# EAGLE schematic rgblight (EAGLE 5.06)
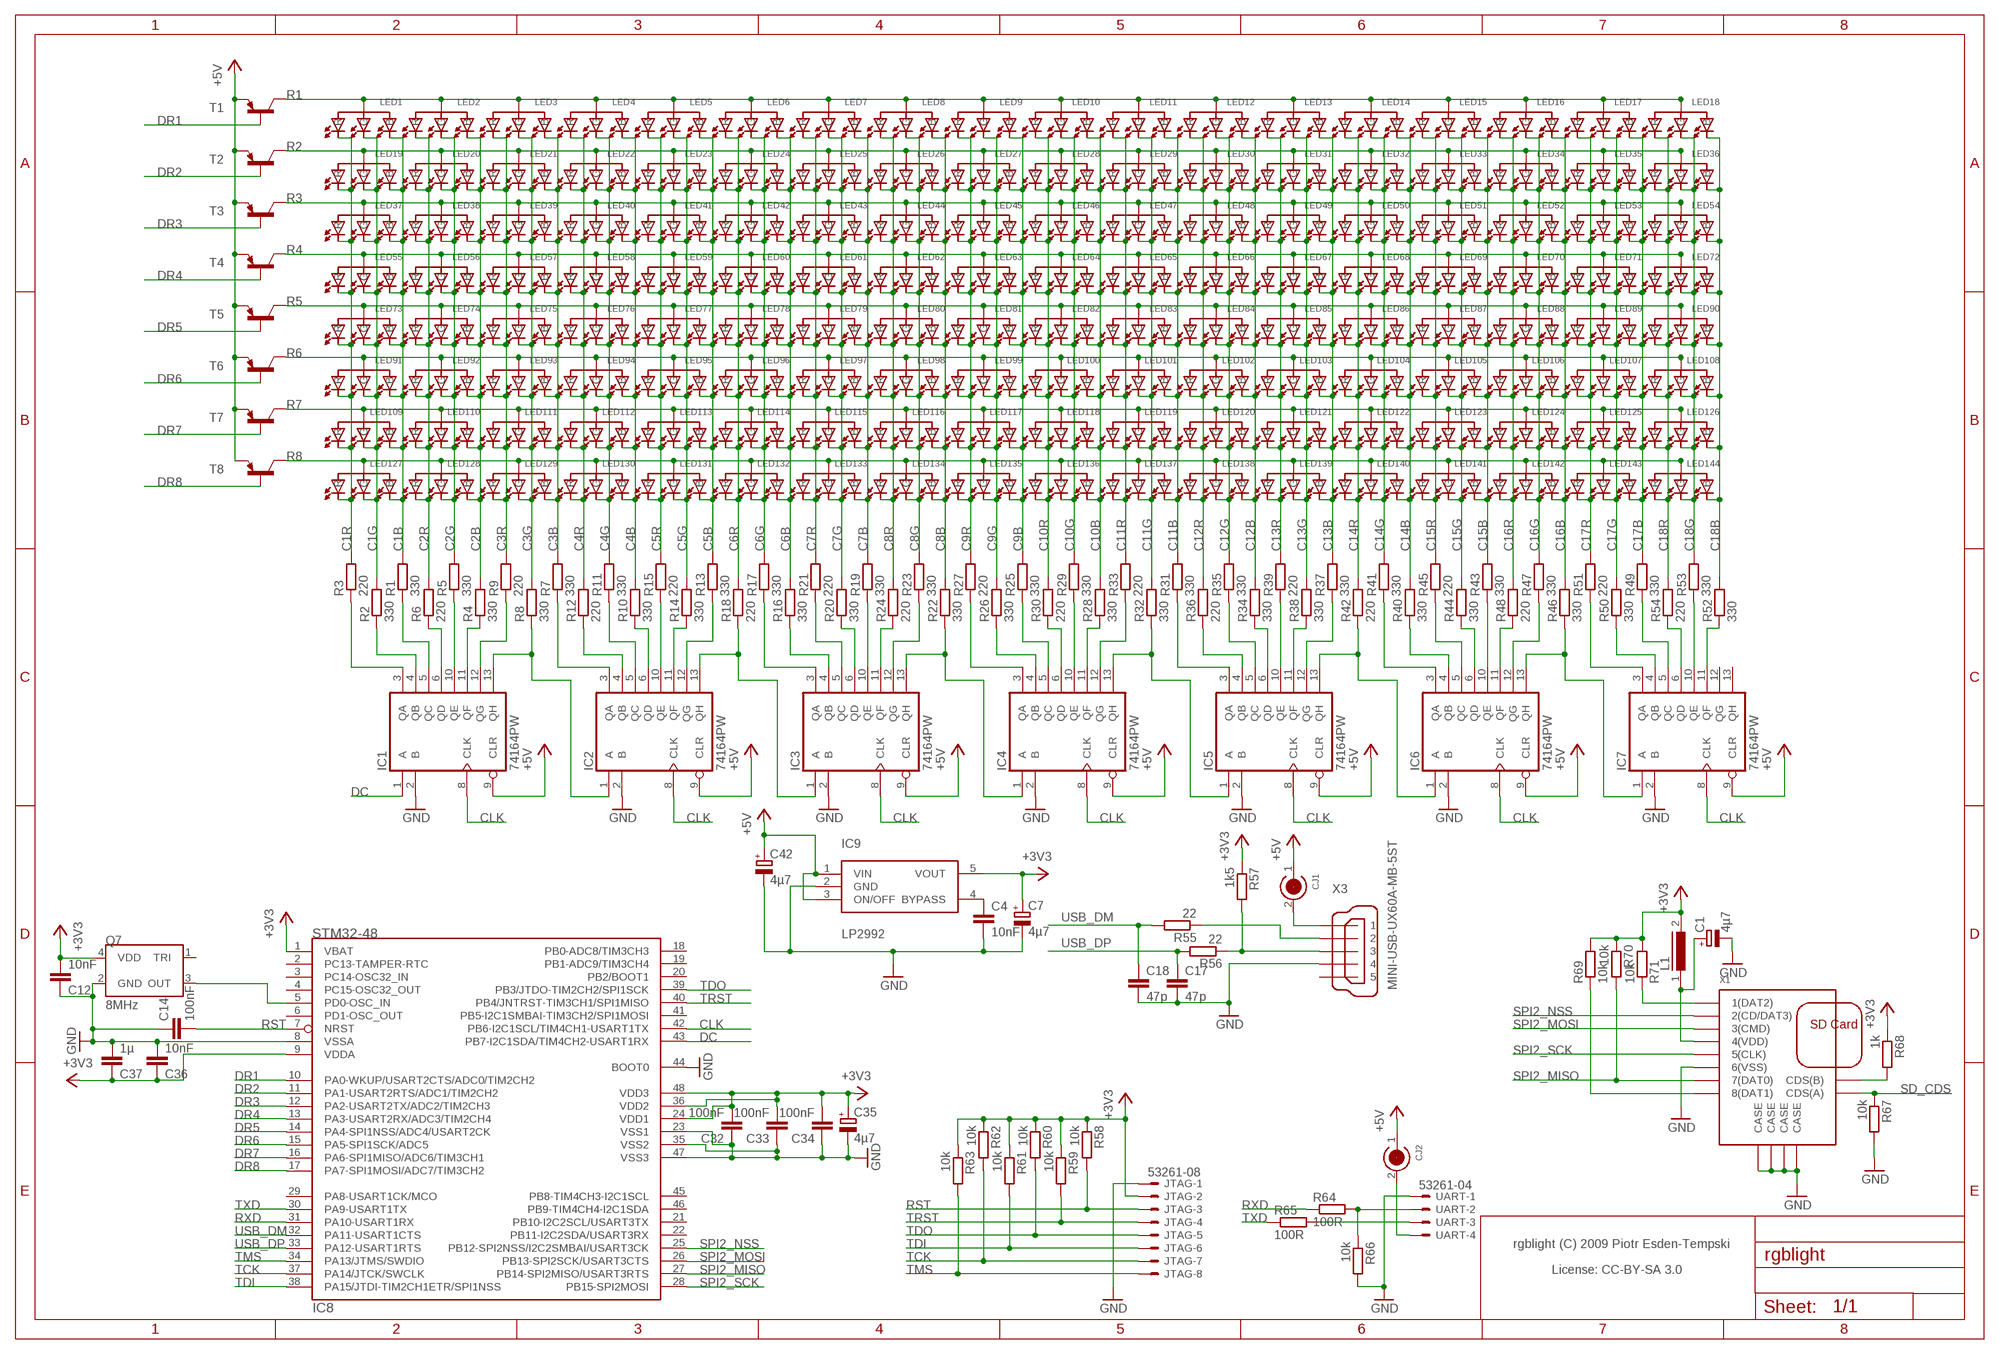
[diagram p0: schematic, sheet 1]

## Parts
C1  4µ7  CPOL-EUA/3216-18R  [A/3216-18R]
C4  10nF  C-EUC0402  [C0402]
C7  4µ7  CPOL-EUA/3216-18R  [A/3216-18R]
C12  10nF  C-EUC0402  [C0402]
C14  100nF  C-EUC0402  [C0402]
C17  47p  C-EUC0402  [C0402]
C18  47p  C-EUC0402  [C0402]
C32  100nF  C-EUC0402  [C0402]
C33  100nF  C-EUC0402  [C0402]
C34  100nF  C-EUC0402  [C0402]
C35  4µ7  CPOL-EUA/3216-18R  [A/3216-18R]
C36  10nF  C-EUC0402  [C0402]
C37  1µ  C-EUC0402  [C0402]
C42  4µ7  CPOL-EUA/3216-18R  [A/3216-18R]
CJ1  CIRC_JMP  [CIRC_JMP]
CJ2  CIRC_JMP  [CIRC_JMP]
IC1  74164PW  [TSSOP14]
IC2  74164PW  [TSSOP14]
IC3  74164PW  [TSSOP14]
IC4  74164PW  [TSSOP14]
IC5  74164PW  [TSSOP14]
IC6  74164PW  [TSSOP14]
IC7  74164PW  [TSSOP14]
IC8  STM32-48  [TQFP48]
IC9  LP2992  [SOT23-5]
JTAG  53261-08  [53261-08]
L1  I0603  [R0603]
LED1  OVSRRGB  [OVSRRGB]
LED2  OVSRRGB  [OVSRRGB]
LED3  OVSRRGB  [OVSRRGB]
LED4  OVSRRGB  [OVSRRGB]
LED5  OVSRRGB  [OVSRRGB]
LED6  OVSRRGB  [OVSRRGB]
LED7  OVSRRGB  [OVSRRGB]
LED8  OVSRRGB  [OVSRRGB]
LED9  OVSRRGB  [OVSRRGB]
LED10  OVSRRGB  [OVSRRGB]
LED11  OVSRRGB  [OVSRRGB]
LED12  OVSRRGB  [OVSRRGB]
LED13  OVSRRGB  [OVSRRGB]
LED14  OVSRRGB  [OVSRRGB]
LED15  OVSRRGB  [OVSRRGB]
LED16  OVSRRGB  [OVSRRGB]
LED17  OVSRRGB  [OVSRRGB]
LED18  OVSRRGB  [OVSRRGB]
LED19  OVSRRGB  [OVSRRGB]
LED20  OVSRRGB  [OVSRRGB]
LED21  OVSRRGB  [OVSRRGB]
LED22  OVSRRGB  [OVSRRGB]
LED23  OVSRRGB  [OVSRRGB]
LED24  OVSRRGB  [OVSRRGB]
LED25  OVSRRGB  [OVSRRGB]
LED26  OVSRRGB  [OVSRRGB]
LED27  OVSRRGB  [OVSRRGB]
LED28  OVSRRGB  [OVSRRGB]
LED29  OVSRRGB  [OVSRRGB]
LED30  OVSRRGB  [OVSRRGB]
LED31  OVSRRGB  [OVSRRGB]
LED32  OVSRRGB  [OVSRRGB]
LED33  OVSRRGB  [OVSRRGB]
LED34  OVSRRGB  [OVSRRGB]
LED35  OVSRRGB  [OVSRRGB]
LED36  OVSRRGB  [OVSRRGB]
LED37  OVSRRGB  [OVSRRGB]
LED38  OVSRRGB  [OVSRRGB]
LED39  OVSRRGB  [OVSRRGB]
LED40  OVSRRGB  [OVSRRGB]
LED41  OVSRRGB  [OVSRRGB]
LED42  OVSRRGB  [OVSRRGB]
LED43  OVSRRGB  [OVSRRGB]
LED44  OVSRRGB  [OVSRRGB]
LED45  OVSRRGB  [OVSRRGB]
LED46  OVSRRGB  [OVSRRGB]
LED47  OVSRRGB  [OVSRRGB]
LED48  OVSRRGB  [OVSRRGB]
LED49  OVSRRGB  [OVSRRGB]
LED50  OVSRRGB  [OVSRRGB]
LED51  OVSRRGB  [OVSRRGB]
LED52  OVSRRGB  [OVSRRGB]
LED53  OVSRRGB  [OVSRRGB]
LED54  OVSRRGB  [OVSRRGB]
LED55  OVSRRGB  [OVSRRGB]
LED56  OVSRRGB  [OVSRRGB]
LED57  OVSRRGB  [OVSRRGB]
LED58  OVSRRGB  [OVSRRGB]
LED59  OVSRRGB  [OVSRRGB]
LED60  OVSRRGB  [OVSRRGB]
LED61  OVSRRGB  [OVSRRGB]
LED62  OVSRRGB  [OVSRRGB]
LED63  OVSRRGB  [OVSRRGB]
LED64  OVSRRGB  [OVSRRGB]
LED65  OVSRRGB  [OVSRRGB]
LED66  OVSRRGB  [OVSRRGB]
LED67  OVSRRGB  [OVSRRGB]
LED68  OVSRRGB  [OVSRRGB]
LED69  OVSRRGB  [OVSRRGB]
LED70  OVSRRGB  [OVSRRGB]
LED71  OVSRRGB  [OVSRRGB]
LED72  OVSRRGB  [OVSRRGB]
LED73  OVSRRGB  [OVSRRGB]
LED74  OVSRRGB  [OVSRRGB]
LED75  OVSRRGB  [OVSRRGB]
LED76  OVSRRGB  [OVSRRGB]
LED77  OVSRRGB  [OVSRRGB]
LED78  OVSRRGB  [OVSRRGB]
LED79  OVSRRGB  [OVSRRGB]
LED80  OVSRRGB  [OVSRRGB]
LED81  OVSRRGB  [OVSRRGB]
LED82  OVSRRGB  [OVSRRGB]
LED83  OVSRRGB  [OVSRRGB]
LED84  OVSRRGB  [OVSRRGB]
LED85  OVSRRGB  [OVSRRGB]
LED86  OVSRRGB  [OVSRRGB]
LED87  OVSRRGB  [OVSRRGB]
LED88  OVSRRGB  [OVSRRGB]
LED89  OVSRRGB  [OVSRRGB]
LED90  OVSRRGB  [OVSRRGB]
LED91  OVSRRGB  [OVSRRGB]
LED92  OVSRRGB  [OVSRRGB]
LED93  OVSRRGB  [OVSRRGB]
LED94  OVSRRGB  [OVSRRGB]
LED95  OVSRRGB  [OVSRRGB]
LED96  OVSRRGB  [OVSRRGB]
LED97  OVSRRGB  [OVSRRGB]
LED98  OVSRRGB  [OVSRRGB]
LED99  OVSRRGB  [OVSRRGB]
LED100  OVSRRGB  [OVSRRGB]
LED101  OVSRRGB  [OVSRRGB]
LED102  OVSRRGB  [OVSRRGB]
LED103  OVSRRGB  [OVSRRGB]
LED104  OVSRRGB  [OVSRRGB]
LED105  OVSRRGB  [OVSRRGB]
LED106  OVSRRGB  [OVSRRGB]
LED107  OVSRRGB  [OVSRRGB]
LED108  OVSRRGB  [OVSRRGB]
LED109  OVSRRGB  [OVSRRGB]
LED110  OVSRRGB  [OVSRRGB]
LED111  OVSRRGB  [OVSRRGB]
LED112  OVSRRGB  [OVSRRGB]
LED113  OVSRRGB  [OVSRRGB]
LED114  OVSRRGB  [OVSRRGB]
LED115  OVSRRGB  [OVSRRGB]
LED116  OVSRRGB  [OVSRRGB]
LED117  OVSRRGB  [OVSRRGB]
LED118  OVSRRGB  [OVSRRGB]
LED119  OVSRRGB  [OVSRRGB]
LED120  OVSRRGB  [OVSRRGB]
LED121  OVSRRGB  [OVSRRGB]
LED122  OVSRRGB  [OVSRRGB]
LED123  OVSRRGB  [OVSRRGB]
LED124  OVSRRGB  [OVSRRGB]
LED125  OVSRRGB  [OVSRRGB]
LED126  OVSRRGB  [OVSRRGB]
LED127  OVSRRGB  [OVSRRGB]
LED128  OVSRRGB  [OVSRRGB]
LED129  OVSRRGB  [OVSRRGB]
LED130  OVSRRGB  [OVSRRGB]
LED131  OVSRRGB  [OVSRRGB]
LED132  OVSRRGB  [OVSRRGB]
LED133  OVSRRGB  [OVSRRGB]
LED134  OVSRRGB  [OVSRRGB]
LED135  OVSRRGB  [OVSRRGB]
LED136  OVSRRGB  [OVSRRGB]
LED137  OVSRRGB  [OVSRRGB]
LED138  OVSRRGB  [OVSRRGB]
LED139  OVSRRGB  [OVSRRGB]
LED140  OVSRRGB  [OVSRRGB]
LED141  OVSRRGB  [OVSRRGB]
LED142  OVSRRGB  [OVSRRGB]
LED143  OVSRRGB  [OVSRRGB]
LED144  OVSRRGB  [OVSRRGB]
Q7  8MHz  ASE_ASCILLATOR  [ASE_OSCILLATOR]
R1  330  R-EU_R0402  [R0402]
R2  330  R-EU_R0402  [R0402]
R3  220  R-EU_R0402  [R0402]
R4  330  R-EU_R0402  [R0402]
R5  330  R-EU_R0402  [R0402]
R6  220  R-EU_R0402  [R0402]
R7  330  R-EU_R0402  [R0402]
R8  330  R-EU_R0402  [R0402]
R9  220  R-EU_R0402  [R0402]
R10  330  R-EU_R0402  [R0402]
R11  330  R-EU_R0402  [R0402]
R12  220  R-EU_R0402  [R0402]
R13  330  R-EU_R0402  [R0402]
R14  330  R-EU_R0402  [R0402]
R15  220  R-EU_R0402  [R0402]
R16  330  R-EU_R0402  [R0402]
R17  330  R-EU_R0402  [R0402]
R18  220  R-EU_R0402  [R0402]
R19  330  R-EU_R0402  [R0402]
R20  330  R-EU_R0402  [R0402]
R21  220  R-EU_R0402  [R0402]
R22  330  R-EU_R0402  [R0402]
R23  330  R-EU_R0402  [R0402]
R24  220  R-EU_R0402  [R0402]
R25  330  R-EU_R0402  [R0402]
R26  330  R-EU_R0402  [R0402]
R27  220  R-EU_R0402  [R0402]
R28  330  R-EU_R0402  [R0402]
R29  330  R-EU_R0402  [R0402]
R30  220  R-EU_R0402  [R0402]
R31  330  R-EU_R0402  [R0402]
R32  330  R-EU_R0402  [R0402]
R33  220  R-EU_R0402  [R0402]
R34  330  R-EU_R0402  [R0402]
R35  330  R-EU_R0402  [R0402]
R36  220  R-EU_R0402  [R0402]
R37  330  R-EU_R0402  [R0402]
R38  330  R-EU_R0402  [R0402]
R39  220  R-EU_R0402  [R0402]
R40  330  R-EU_R0402  [R0402]
R41  330  R-EU_R0402  [R0402]
R42  220  R-EU_R0402  [R0402]
R43  330  R-EU_R0402  [R0402]
R44  330  R-EU_R0402  [R0402]
R45  220  R-EU_R0402  [R0402]
R46  330  R-EU_R0402  [R0402]
R47  330  R-EU_R0402  [R0402]
R48  220  R-EU_R0402  [R0402]
R49  330  R-EU_R0402  [R0402]
R50  330  R-EU_R0402  [R0402]
R51  220  R-EU_R0402  [R0402]
R52  330  R-EU_R0402  [R0402]
R53  330  R-EU_R0402  [R0402]
R54  220  R-EU_R0402  [R0402]
R55  22  R-EU_R0402  [R0402]
R56  22  R-EU_R0402  [R0402]
R57  1k5  R-EU_R0402  [R0402]
R58  10k  R-EU_R0402  [R0402]
R59  10k  R-EU_R0402  [R0402]
R60  10k  R-EU_R0402  [R0402]
R61  10k  R-EU_R0402  [R0402]
R62  10k  R-EU_R0402  [R0402]
R63  10k  R-EU_R0402  [R0402]
R64  100R  R-EU_R0402  [R0402]
R65  100R  R-EU_R0402  [R0402]
R66  10k  R-EU_R0402  [R0402]
R67  10k  R-EU_R0402  [R0402]
R68  1k  R-EU_R0402  [R0402]
R69  10k  R-EU_R0402  [R0402]
R70  10k  R-EU_R0402  [R0402]
R71  10k  R-EU_R0402  [R0402]
T1  -PNP-SOT23-BCE  [SOT23-BCE]
T2  -PNP-SOT23-BCE  [SOT23-BCE]
T3  -PNP-SOT23-BCE  [SOT23-BCE]
T4  -PNP-SOT23-BCE  [SOT23-BCE]
T5  -PNP-SOT23-BCE  [SOT23-BCE]
T6  -PNP-SOT23-BCE  [SOT23-BCE]
T7  -PNP-SOT23-BCE  [SOT23-BCE]
T8  -PNP-SOT23-BCE  [SOT23-BCE]
UART  53261-04  [53261-04]
X1  SD-SLOT-DM3D-SF  [DM3D-SF]
X3  MINI-USB-UX60A-MB-5ST  [UX60A-MB-5ST]

## Nets
+3V3: C7.+ C12.2 C32.2 C33.2 C34.2 C35.+ C36.1 C37.1 IC8.1(VBAT) IC8.9(VDDA) IC8.24(VDD1) IC8.36(VDD2) IC8.48(VDD3) IC9.5(VOUT) JTAG.2 L1.2 Q7.4(VDD) R57.1 R58.1 R59.1 R60.1 R61.1 R62.1 R63.1 R68.1 R69.2 R70.1 R71.2
+5V: C42.+ CJ1.1 CJ2.1 IC1.9(CLR) IC2.9(CLR) IC3.9(CLR) IC4.9(CLR) IC5.9(CLR) IC6.9(CLR) IC7.9(CLR) IC9.1(VIN) IC9.3(ON/OFF) T1.E T2.E T3.E T4.E T5.E T6.E T7.E T8.E
C1B: LED1.3(B) LED19.3(B) LED37.3(B) LED55.3(B) LED73.3(B) LED91.3(B) LED109.3(B) LED127.3(B) R1.2
C1G: LED1.2(G) LED19.2(G) LED37.2(G) LED55.2(G) LED73.2(G) LED91.2(G) LED109.2(G) LED127.2(G) R2.2
C1R: LED1.1(R) LED19.1(R) LED37.1(R) LED55.1(R) LED73.1(R) LED91.1(R) LED109.1(R) LED127.1(R) R3.2
C2B: LED2.3(B) LED20.3(B) LED38.3(B) LED56.3(B) LED74.3(B) LED92.3(B) LED110.3(B) LED128.3(B) R4.2
C2G: LED2.2(G) LED20.2(G) LED38.2(G) LED56.2(G) LED74.2(G) LED92.2(G) LED110.2(G) LED128.2(G) R5.2
C2R: LED2.1(R) LED20.1(R) LED38.1(R) LED56.1(R) LED74.1(R) LED92.1(R) LED110.1(R) LED128.1(R) R6.2
C3B: LED3.3(B) LED21.3(B) LED39.3(B) LED57.3(B) LED75.3(B) LED93.3(B) LED111.3(B) LED129.3(B) R7.2
C3G: LED3.2(G) LED21.2(G) LED39.2(G) LED57.2(G) LED75.2(G) LED93.2(G) LED111.2(G) LED129.2(G) R8.2
C3R: LED3.1(R) LED21.1(R) LED39.1(R) LED57.1(R) LED75.1(R) LED93.1(R) LED111.1(R) LED129.1(R) R9.2
C4B: LED4.3(B) LED22.3(B) LED40.3(B) LED58.3(B) LED76.3(B) LED94.3(B) LED112.3(B) LED130.3(B) R10.2
C4G: LED4.2(G) LED22.2(G) LED40.2(G) LED58.2(G) LED76.2(G) LED94.2(G) LED112.2(G) LED130.2(G) R11.2
C4R: LED4.1(R) LED22.1(R) LED40.1(R) LED58.1(R) LED76.1(R) LED94.1(R) LED112.1(R) LED130.1(R) R12.2
C5B: LED5.3(B) LED23.3(B) LED41.3(B) LED59.3(B) LED77.3(B) LED95.3(B) LED113.3(B) LED131.3(B) R13.2
C5G: LED5.2(G) LED23.2(G) LED41.2(G) LED59.2(G) LED77.2(G) LED95.2(G) LED113.2(G) LED131.2(G) R14.2
C5R: LED5.1(R) LED23.1(R) LED41.1(R) LED59.1(R) LED77.1(R) LED95.1(R) LED113.1(R) LED131.1(R) R15.2
C6B: LED6.3(B) LED24.3(B) LED42.3(B) LED60.3(B) LED78.3(B) LED96.3(B) LED114.3(B) LED132.3(B) R16.2
C6G: LED6.2(G) LED24.2(G) LED42.2(G) LED60.2(G) LED78.2(G) LED96.2(G) LED114.2(G) LED132.2(G) R17.2
C6R: LED6.1(R) LED24.1(R) LED42.1(R) LED60.1(R) LED78.1(R) LED96.1(R) LED114.1(R) LED132.1(R) R18.2
C7B: LED7.3(B) LED25.3(B) LED43.3(B) LED61.3(B) LED79.3(B) LED97.3(B) LED115.3(B) LED133.3(B) R19.2
C7G: LED7.2(G) LED25.2(G) LED43.2(G) LED61.2(G) LED79.2(G) LED97.2(G) LED115.2(G) LED133.2(G) R20.2
C7R: LED7.1(R) LED25.1(R) LED43.1(R) LED61.1(R) LED79.1(R) LED97.1(R) LED115.1(R) LED133.1(R) R21.2
C8B: LED8.3(B) LED26.3(B) LED44.3(B) LED62.3(B) LED80.3(B) LED98.3(B) LED116.3(B) LED134.3(B) R22.2
C8G: LED8.2(G) LED26.2(G) LED44.2(G) LED62.2(G) LED80.2(G) LED98.2(G) LED116.2(G) LED134.2(G) R23.2
C8R: LED8.1(R) LED26.1(R) LED44.1(R) LED62.1(R) LED80.1(R) LED98.1(R) LED116.1(R) LED134.1(R) R24.2
C9B: LED9.3(B) LED27.3(B) LED45.3(B) LED63.3(B) LED81.3(B) LED99.3(B) LED117.3(B) LED135.3(B) R25.2
C9G: LED9.2(G) LED27.2(G) LED45.2(G) LED63.2(G) LED81.2(G) LED99.2(G) LED117.2(G) LED135.2(G) R26.2
C9R: LED9.1(R) LED27.1(R) LED45.1(R) LED63.1(R) LED81.1(R) LED99.1(R) LED117.1(R) LED135.1(R) R27.2
C10B: LED10.3(B) LED28.3(B) LED46.3(B) LED64.3(B) LED82.3(B) LED100.3(B) LED118.3(B) LED136.3(B) R28.2
C10G: LED10.2(G) LED28.2(G) LED46.2(G) LED64.2(G) LED82.2(G) LED100.2(G) LED118.2(G) LED136.2(G) R29.2
C10R: LED10.1(R) LED28.1(R) LED46.1(R) LED64.1(R) LED82.1(R) LED100.1(R) LED118.1(R) LED136.1(R) R30.2
C11B: LED11.3(B) LED29.3(B) LED47.3(B) LED65.3(B) LED83.3(B) LED101.3(B) LED119.3(B) LED137.3(B) R31.2
C11G: LED11.2(G) LED29.2(G) LED47.2(G) LED65.2(G) LED83.2(G) LED101.2(G) LED119.2(G) LED137.2(G) R32.2
C11R: LED11.1(R) LED29.1(R) LED47.1(R) LED65.1(R) LED83.1(R) LED101.1(R) LED119.1(R) LED137.1(R) R33.2
C12B: LED12.3(B) LED30.3(B) LED48.3(B) LED66.3(B) LED84.3(B) LED102.3(B) LED120.3(B) LED138.3(B) R34.2
C12G: LED12.2(G) LED30.2(G) LED48.2(G) LED66.2(G) LED84.2(G) LED102.2(G) LED120.2(G) LED138.2(G) R35.2
C12R: LED12.1(R) LED30.1(R) LED48.1(R) LED66.1(R) LED84.1(R) LED102.1(R) LED120.1(R) LED138.1(R) R36.2
C13B: LED13.3(B) LED31.3(B) LED49.3(B) LED67.3(B) LED85.3(B) LED103.3(B) LED121.3(B) LED139.3(B) R37.2
C13G: LED13.2(G) LED31.2(G) LED49.2(G) LED67.2(G) LED85.2(G) LED103.2(G) LED121.2(G) LED139.2(G) R38.2
C13R: LED13.1(R) LED31.1(R) LED49.1(R) LED67.1(R) LED85.1(R) LED103.1(R) LED121.1(R) LED139.1(R) R39.2
C14B: LED14.3(B) LED32.3(B) LED50.3(B) LED68.3(B) LED86.3(B) LED104.3(B) LED122.3(B) LED140.3(B) R40.2
C14G: LED14.2(G) LED32.2(G) LED50.2(G) LED68.2(G) LED86.2(G) LED104.2(G) LED122.2(G) LED140.2(G) R41.2
C14R: LED14.1(R) LED32.1(R) LED50.1(R) LED68.1(R) LED86.1(R) LED104.1(R) LED122.1(R) LED140.1(R) R42.2
C15B: LED15.3(B) LED33.3(B) LED51.3(B) LED69.3(B) LED87.3(B) LED105.3(B) LED123.3(B) LED141.3(B) R43.2
C15G: LED15.2(G) LED33.2(G) LED51.2(G) LED69.2(G) LED87.2(G) LED105.2(G) LED123.2(G) LED141.2(G) R44.2
C15R: LED15.1(R) LED33.1(R) LED51.1(R) LED69.1(R) LED87.1(R) LED105.1(R) LED123.1(R) LED141.1(R) R45.2
C16B: LED16.3(B) LED34.3(B) LED52.3(B) LED70.3(B) LED88.3(B) LED106.3(B) LED124.3(B) LED142.3(B) R46.2
C16G: LED16.2(G) LED34.2(G) LED52.2(G) LED70.2(G) LED88.2(G) LED106.2(G) LED124.2(G) LED142.2(G) R47.2
C16R: LED16.1(R) LED34.1(R) LED52.1(R) LED70.1(R) LED88.1(R) LED106.1(R) LED124.1(R) LED142.1(R) R48.2
C17B: LED17.3(B) LED35.3(B) LED53.3(B) LED71.3(B) LED89.3(B) LED107.3(B) LED125.3(B) LED143.3(B) R49.2
C17G: LED17.2(G) LED35.2(G) LED53.2(G) LED71.2(G) LED89.2(G) LED107.2(G) LED125.2(G) LED143.2(G) R50.2
C17R: LED17.1(R) LED35.1(R) LED53.1(R) LED71.1(R) LED89.1(R) LED107.1(R) LED125.1(R) LED143.1(R) R51.2
C18B: LED18.3(B) LED36.3(B) LED54.3(B) LED72.3(B) LED90.3(B) LED108.3(B) LED126.3(B) LED144.3(B) R52.2
C18G: LED18.2(G) LED36.2(G) LED54.2(G) LED72.2(G) LED90.2(G) LED108.2(G) LED126.2(G) LED144.2(G) R53.2
C18R: LED18.1(R) LED36.1(R) LED54.1(R) LED72.1(R) LED90.1(R) LED108.1(R) LED126.1(R) LED144.1(R) R54.2
CLK: IC1.8(CLK) IC2.8(CLK) IC3.8(CLK) IC4.8(CLK) IC5.8(CLK) IC6.8(CLK) IC7.8(CLK) IC8.42(PB6-I2C1SCL/TIM4CH1-USART1TX)
DC: IC1.1(A) IC8.43(PB7-I2C1SDA/TIM4CH2-USART1RX)
DR1: IC8.10(PA0-WKUP/USART2CTS/ADC0/TIM2CH2) T1.B
DR2: IC8.11(PA1-USART2RTS/ADC1/TIM2CH2) T2.B
DR3: IC8.12(PA2-USART2TX/ADC2/TIM2CH3) T3.B
DR4: IC8.13(PA3-USART2RX/ADC3/TIM2CH4) T4.B
DR5: IC8.14(PA4-SPI1NSS/ADC4/USART2CK) T5.B
DR6: IC8.15(PA5-SPI1SCK/ADC5) T6.B
DR7: IC8.16(PA6-SPI1MISO/ADC6/TIM3CH1) T7.B
DR8: IC8.17(PA7-SPI1MOSI/ADC7/TIM3CH2) T8.B
GND: C1.- C4.2 C7.- C12.1 C14.1 C17.2 C18.2 C32.1 C33.1 C34.1 C35.- C36.2 C37.2 C42.- IC1.2(B) IC2.2(B) IC3.2(B) IC4.2(B) IC5.2(B) IC6.2(B) IC7.2(B) IC8.8(VSSA) IC8.23(VSS1) IC8.35(VSS2) IC8.44(BOOT0) IC8.47(VSS3) IC9.2(GND) JTAG.1 Q7.2(GND) R66.2 R67.2 UART.1 X1.6(VSS) X1.CASE0(CASE) X1.CASE1(CASE) X1.CASE2(CASE) X1.CASE3(CASE) X3.4
N$2: IC1.3(QA) R3.1
N$3: IC1.4(QB) R2.1
N$4: IC1.5(QC) R1.1
N$9: IC1.6(QD) R6.1
N$10: IC1.10(QE) R5.1
N$11: IC1.11(QF) R4.1
N$12: IC1.12(QG) R9.1
N$13: IC1.13(QH) IC2.1(A) R8.1
N$14: IC2.3(QA) R7.1
N$15: IC2.4(QB) R12.1
N$16: IC2.5(QC) R11.1
N$17: IC2.6(QD) R10.1
N$18: IC2.10(QE) R15.1
N$19: IC2.11(QF) R14.1
N$20: IC2.12(QG) R13.1
N$21: IC2.13(QH) IC3.1(A) R18.1
N$22: IC3.3(QA) R17.1
N$23: IC3.4(QB) R16.1
N$24: IC3.5(QC) R21.1
N$25: IC3.6(QD) R20.1
N$26: IC3.10(QE) R19.1
N$27: IC3.11(QF) R24.1
N$28: IC3.12(QG) R23.1
N$29: IC3.13(QH) IC4.1(A) R22.1
N$30: IC4.3(QA) R27.1
N$31: IC4.4(QB) R26.1
N$32: IC4.5(QC) R25.1
N$33: IC4.6(QD) R30.1
N$34: IC4.10(QE) R29.1
N$35: IC4.11(QF) R28.1
N$36: IC4.12(QG) R33.1
N$37: IC4.13(QH) IC5.1(A) R32.1
N$38: IC5.3(QA) R31.1
N$39: IC5.4(QB) R36.1
N$40: IC5.5(QC) R35.1
N$41: IC5.6(QD) R34.1
N$42: IC5.10(QE) R39.1
N$43: IC5.11(QF) R38.1
N$44: IC5.12(QG) R37.1
N$45: IC5.13(QH) IC6.1(A) R42.1
N$46: IC6.3(QA) R41.1
N$47: IC6.4(QB) R40.1
N$48: IC6.5(QC) R45.1
N$49: IC6.6(QD) R44.1
N$50: IC6.10(QE) R43.1
N$51: IC6.11(QF) R48.1
N$52: IC6.12(QG) R47.1
N$53: IC6.13(QH) IC7.1(A) R46.1
N$54: IC7.3(QA) R51.1
N$55: IC7.4(QB) R50.1
N$56: IC7.5(QC) R49.1
N$57: IC7.6(QD) R54.1
N$58: IC7.10(QE) R53.1
N$59: IC7.11(QF) R52.1
N$60: IC8.5(PD0-OSC_IN) Q7.3(OUT)
N$61: C4.1 IC9.4(BYPASS)
N$62: CJ1.2 X3.1
N$63: R56.1 R57.2 X3.3
N$64: R55.1 X3.2
N$65: R64.2 R66.1 UART.2
N$66: R68.2 X1.CDS(B)
N$67: R65.2 UART.3
N$68: CJ2.2 UART.4
N$70: C1.+ L1.1 X1.4(VDD)
N$71: R71.1 X1.1(DAT2)
N$73: R69.1 X1.8(DAT1)
R1: LED1.4(A) LED2.4(A) LED3.4(A) LED4.4(A) LED5.4(A) LED6.4(A) LED7.4(A) LED8.4(A) LED9.4(A) LED10.4(A) LED11.4(A) LED12.4(A) LED13.4(A) LED14.4(A) LED15.4(A) LED16.4(A) LED17.4(A) LED18.4(A) T1.C
R2: LED19.4(A) LED20.4(A) LED21.4(A) LED22.4(A) LED23.4(A) LED24.4(A) LED25.4(A) LED26.4(A) LED27.4(A) LED28.4(A) LED29.4(A) LED30.4(A) LED31.4(A) LED32.4(A) LED33.4(A) LED34.4(A) LED35.4(A) LED36.4(A) T2.C
R3: LED37.4(A) LED38.4(A) LED39.4(A) LED40.4(A) LED41.4(A) LED42.4(A) LED43.4(A) LED44.4(A) LED45.4(A) LED46.4(A) LED47.4(A) LED48.4(A) LED49.4(A) LED50.4(A) LED51.4(A) LED52.4(A) LED53.4(A) LED54.4(A) T3.C
R4: LED55.4(A) LED56.4(A) LED57.4(A) LED58.4(A) LED59.4(A) LED60.4(A) LED61.4(A) LED62.4(A) LED63.4(A) LED64.4(A) LED65.4(A) LED66.4(A) LED67.4(A) LED68.4(A) LED69.4(A) LED70.4(A) LED71.4(A) LED72.4(A) T4.C
R5: LED73.4(A) LED74.4(A) LED75.4(A) LED76.4(A) LED77.4(A) LED78.4(A) LED79.4(A) LED80.4(A) LED81.4(A) LED82.4(A) LED83.4(A) LED84.4(A) LED85.4(A) LED86.4(A) LED87.4(A) LED88.4(A) LED89.4(A) LED90.4(A) T5.C
R6: LED91.4(A) LED92.4(A) LED93.4(A) LED94.4(A) LED95.4(A) LED96.4(A) LED97.4(A) LED98.4(A) LED99.4(A) LED100.4(A) LED101.4(A) LED102.4(A) LED103.4(A) LED104.4(A) LED105.4(A) LED106.4(A) LED107.4(A) LED108.4(A) T6.C
R7: LED109.4(A) LED110.4(A) LED111.4(A) LED112.4(A) LED113.4(A) LED114.4(A) LED115.4(A) LED116.4(A) LED117.4(A) LED118.4(A) LED119.4(A) LED120.4(A) LED121.4(A) LED122.4(A) LED123.4(A) LED124.4(A) LED125.4(A) LED126.4(A) T7.C
R8: LED127.4(A) LED128.4(A) LED129.4(A) LED130.4(A) LED131.4(A) LED132.4(A) LED133.4(A) LED134.4(A) LED135.4(A) LED136.4(A) LED137.4(A) LED138.4(A) LED139.4(A) LED140.4(A) LED141.4(A) LED142.4(A) LED143.4(A) LED144.4(A) T8.C
RST: C14.2 IC8.7(NRST) JTAG.3 R58.2
RXD: IC8.31(PA10-USART1RX) R64.1
SD_CDS: R67.1 X1.CDS(A)
SPI2_MISO: IC8.27(PB14-SPI2MISO/USART3RTS) R70.2 X1.7(DAT0)
SPI2_MOSI: IC8.26(PB13-SPI2SCK/USART3CTS) X1.3(CMD)
SPI2_NSS: IC8.25(PB12-SPI2NSS/I2C2SMBAI/USART3CK) X1.2(CD/DAT3)
SPI2_SCK: IC8.28(PB15-SPI2MOSI) X1.5(CLK)
TCK: IC8.37(PA14/JTCK/SWCLK) JTAG.7 R62.2
TDI: IC8.38(PA15/JTDI-TIM2CH1ETR/SPI1NSS) JTAG.6 R61.2
TDO: IC8.39(PB3/JTDO-TIM2CH2/SPI1SCK) JTAG.5 R60.2
TMS: IC8.34(PA13/JTMS/SWDIO) JTAG.8 R63.2
TRST: IC8.40(PB4/JNTRST-TIM3CH1/SPI1MISO) JTAG.4 R59.2
TXD: IC8.30(PA9-USART1TX) R65.1
USB_DM: C18.1 IC8.32(PA11-USART1CTS) R55.2
USB_DP: C17.1 IC8.33(PA12-USART1RTS) R56.2
Unconnected: IC7.12(QG) IC7.13(QH) IC8.2(PC13-TAMPER-RTC) IC8.3(PC14-OSC32_IN) IC8.4(PC15-OSC32_OUT) IC8.6(PD1-OSC_OUT) IC8.18(PB0-ADC8/TIM3CH3) IC8.19(PB1-ADC9/TIM3CH4) IC8.20(PB2/BOOT1) IC8.21(PB10-I2C2SCL/USART3TX) IC8.22(PB11-I2C2SDA/USART3RX) IC8.29(PA8-USART1CK/MCO) IC8.41(PB5-I2C1SMBAI-TIM3CH2/SPI1MOSI) IC8.45(PB8-TIM4CH3-I2C1SCL) IC8.46(PB9-TIM4CH4-I2C1SDA) Q7.1(TRI) X3.5

## Notes on the sheet
- rgblight (C) 2009 Piotr Esden-Tempski
- License: CC-BY-SA 3.0

## Power pins joined to a net without a drawn wire
GND: IC1.7(GND) IC2.7(GND) IC3.7(GND) IC4.7(GND) IC5.7(GND) IC6.7(GND) IC7.7(GND)
VCC: IC1.14(VCC) IC2.14(VCC) IC3.14(VCC) IC4.14(VCC) IC5.14(VCC) IC6.14(VCC) IC7.14(VCC)

## Library data of the parts
C1 C7 C35 C42 = rcl:CPOL-EU: POLARIZED CAPACITOR, European symbol
C4 C12 C14 C17 C18 C32-C34 C36 C37 = resistor:C-EU: CAPACITOR, European symbol
CJ1 CJ2 = fancy_jumpers:CIRC_JMP
IC1-IC7 = shift-registers:74*164: 8-bit parallel out SHIFT REGISTER
IC8 = stm32:STM32-48
IC9 = open-bldc:LP2992
JTAG = con-molex:53?-08: CONNECTOR wire to board 1.25 mm (.049 inch) pitch header
L1 = misc:I0603
LED1-LED144 = rgb-leds:OVSRRGB
Q7 = open-bldc:ASE_ASCILLATOR
R1-R71 = resistor:R-EU_: RESISTOR, European symbol
T1-T8 = transistor:*-PNP-: PNP Transistror
UART = con-molex:53?-04: CONNECTOR wire to board 1.25 mm (.049 inch) pitch header
X1 = sd-slot:SD-SLOT
X3 = con-hirose:MINI-USB-: MINI USB Connector Source: http://www.hirose.co.jp/cataloge_hp/e24000019.pdf